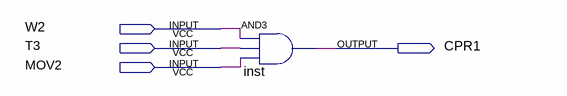
[diagram p0: schematic sheet]
// Quartus schematic CPR1.bdf as structural Verilog: 1 symbols, 4 pins
module CPR1 (
  input  W2,
  input  T3,
  input  MOV2,
  output CPR1
);

  and inst (CPR1, W2, T3, MOV2);
endmodule
